# EAGLE schematic LIBLE (EAGLE 9.6.1)
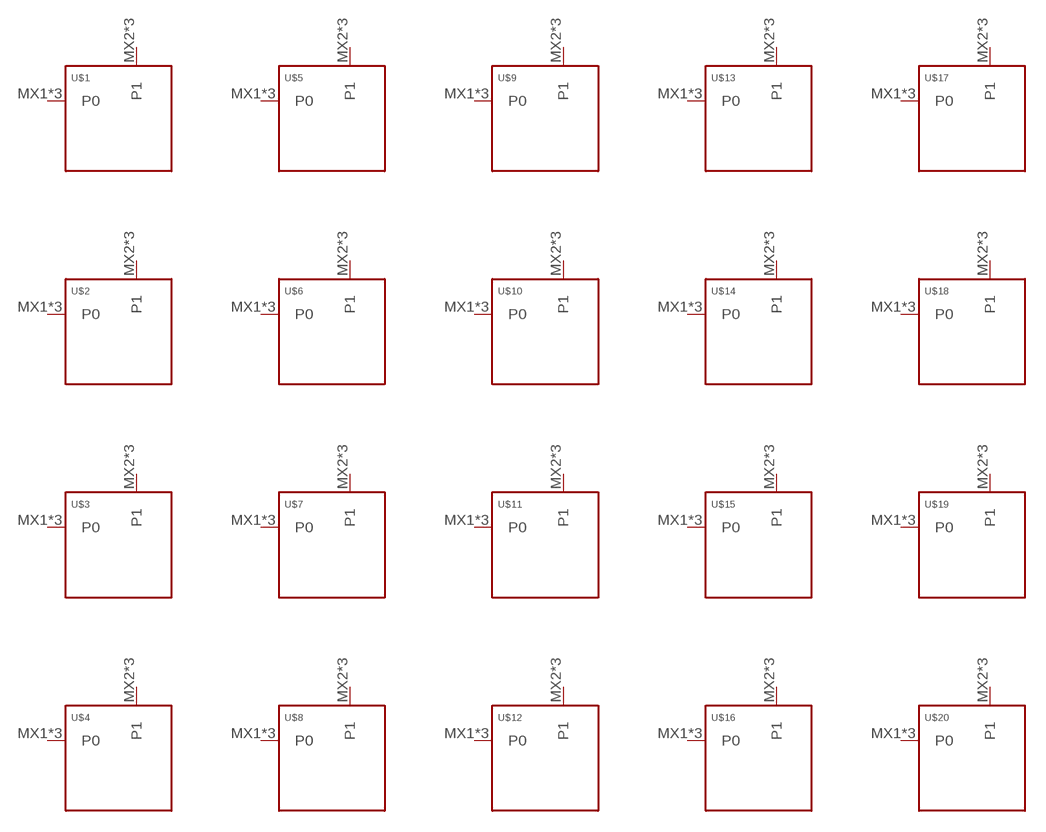
[diagram p0: schematic, sheet 1]

## Parts
U$1  KEYSWITCH-PLAIN-MXHSPCB-1U  [MXHSPCB-1U]
U$2  KEYSWITCH-PLAIN-MXHSPCB-1U  [MXHSPCB-1U]
U$3  KEYSWITCH-PLAIN-MXHSPCB-1U  [MXHSPCB-1U]
U$4  KEYSWITCH-PLAIN-MXHSPCB-1U  [MXHSPCB-1U]
U$5  KEYSWITCH-PLAIN-MXHSPCB-1U  [MXHSPCB-1U]
U$6  KEYSWITCH-PLAIN-MXHSPCB-1U  [MXHSPCB-1U]
U$7  KEYSWITCH-PLAIN-MXHSPCB-1U  [MXHSPCB-1U]
U$8  KEYSWITCH-PLAIN-MXHSPCB-1U  [MXHSPCB-1U]
U$9  KEYSWITCH-PLAIN-MXHSPCB-1U  [MXHSPCB-1U]
U$10  KEYSWITCH-PLAIN-MXHSPCB-1U  [MXHSPCB-1U]
U$11  KEYSWITCH-PLAIN-MXHSPCB-1U  [MXHSPCB-1U]
U$12  KEYSWITCH-PLAIN-MXHSPCB-1U  [MXHSPCB-1U]
U$13  KEYSWITCH-PLAIN-MXHSPCB-1U  [MXHSPCB-1U]
U$14  KEYSWITCH-PLAIN-MXHSPCB-1U  [MXHSPCB-1U]
U$15  KEYSWITCH-PLAIN-MXHSPCB-1U  [MXHSPCB-1U]
U$16  KEYSWITCH-PLAIN-MXHSPCB-1U  [MXHSPCB-1U]
U$17  KEYSWITCH-PLAIN-MXHSPCB-1U  [MXHSPCB-1U]
U$18  KEYSWITCH-PLAIN-MXHSPCB-1U  [MXHSPCB-1U]
U$19  KEYSWITCH-PLAIN-MXHSPCB-1U  [MXHSPCB-1U]
U$20  KEYSWITCH-PLAIN-MXHSPCB-1U  [MXHSPCB-1U]
Unconnected: U$1.MX1(P0) U$1.MX2(P1) U$1.P$1(P0) U$1.P$2(P0) U$1.P$3(P1) U$1.P$4(P1) U$2.MX1(P0) U$2.MX2(P1) U$2.P$1(P0) U$2.P$2(P0) U$2.P$3(P1) U$2.P$4(P1) U$3.MX1(P0) U$3.MX2(P1) U$3.P$1(P0) U$3.P$2(P0) U$3.P$3(P1) U$3.P$4(P1) U$4.MX1(P0) U$4.MX2(P1) U$4.P$1(P0) U$4.P$2(P0) U$4.P$3(P1) U$4.P$4(P1) U$5.MX1(P0) U$5.MX2(P1) U$5.P$1(P0) U$5.P$2(P0) U$5.P$3(P1) U$5.P$4(P1) U$6.MX1(P0) U$6.MX2(P1) U$6.P$1(P0) U$6.P$2(P0) U$6.P$3(P1) U$6.P$4(P1) U$7.MX1(P0) U$7.MX2(P1) U$7.P$1(P0) U$7.P$2(P0) U$7.P$3(P1) U$7.P$4(P1) U$8.MX1(P0) U$8.MX2(P1) U$8.P$1(P0) U$8.P$2(P0) U$8.P$3(P1) U$8.P$4(P1) U$9.MX1(P0) U$9.MX2(P1) U$9.P$1(P0) U$9.P$2(P0) U$9.P$3(P1) U$9.P$4(P1) U$10.MX1(P0) U$10.MX2(P1) U$10.P$1(P0) U$10.P$2(P0) U$10.P$3(P1) U$10.P$4(P1) U$11.MX1(P0) U$11.MX2(P1) U$11.P$1(P0) U$11.P$2(P0) U$11.P$3(P1) U$11.P$4(P1) U$12.MX1(P0) U$12.MX2(P1) U$12.P$1(P0) U$12.P$2(P0) U$12.P$3(P1) U$12.P$4(P1) U$13.MX1(P0) U$13.MX2(P1) U$13.P$1(P0) U$13.P$2(P0) U$13.P$3(P1) U$13.P$4(P1) U$14.MX1(P0) U$14.MX2(P1) U$14.P$1(P0) U$14.P$2(P0) U$14.P$3(P1) U$14.P$4(P1) U$15.MX1(P0) U$15.MX2(P1) U$15.P$1(P0) U$15.P$2(P0) U$15.P$3(P1) U$15.P$4(P1) U$16.MX1(P0) U$16.MX2(P1) U$16.P$1(P0) U$16.P$2(P0) U$16.P$3(P1) U$16.P$4(P1) U$17.MX1(P0) U$17.MX2(P1) U$17.P$1(P0) U$17.P$2(P0) U$17.P$3(P1) U$17.P$4(P1) U$18.MX1(P0) U$18.MX2(P1) U$18.P$1(P0) U$18.P$2(P0) U$18.P$3(P1) U$18.P$4(P1) U$19.MX1(P0) U$19.MX2(P1) U$19.P$1(P0) U$19.P$2(P0) U$19.P$3(P1) U$19.P$4(P1) U$20.MX1(P0) U$20.MX2(P1) U$20.P$1(P0) U$20.P$2(P0) U$20.P$3(P1) U$20.P$4(P1)

## Library data of the parts
U$1-U$20 = Keyboard:KEYSWITCH-PLAIN